# EAGLE design mysensor (EAGLE 7.5.0)
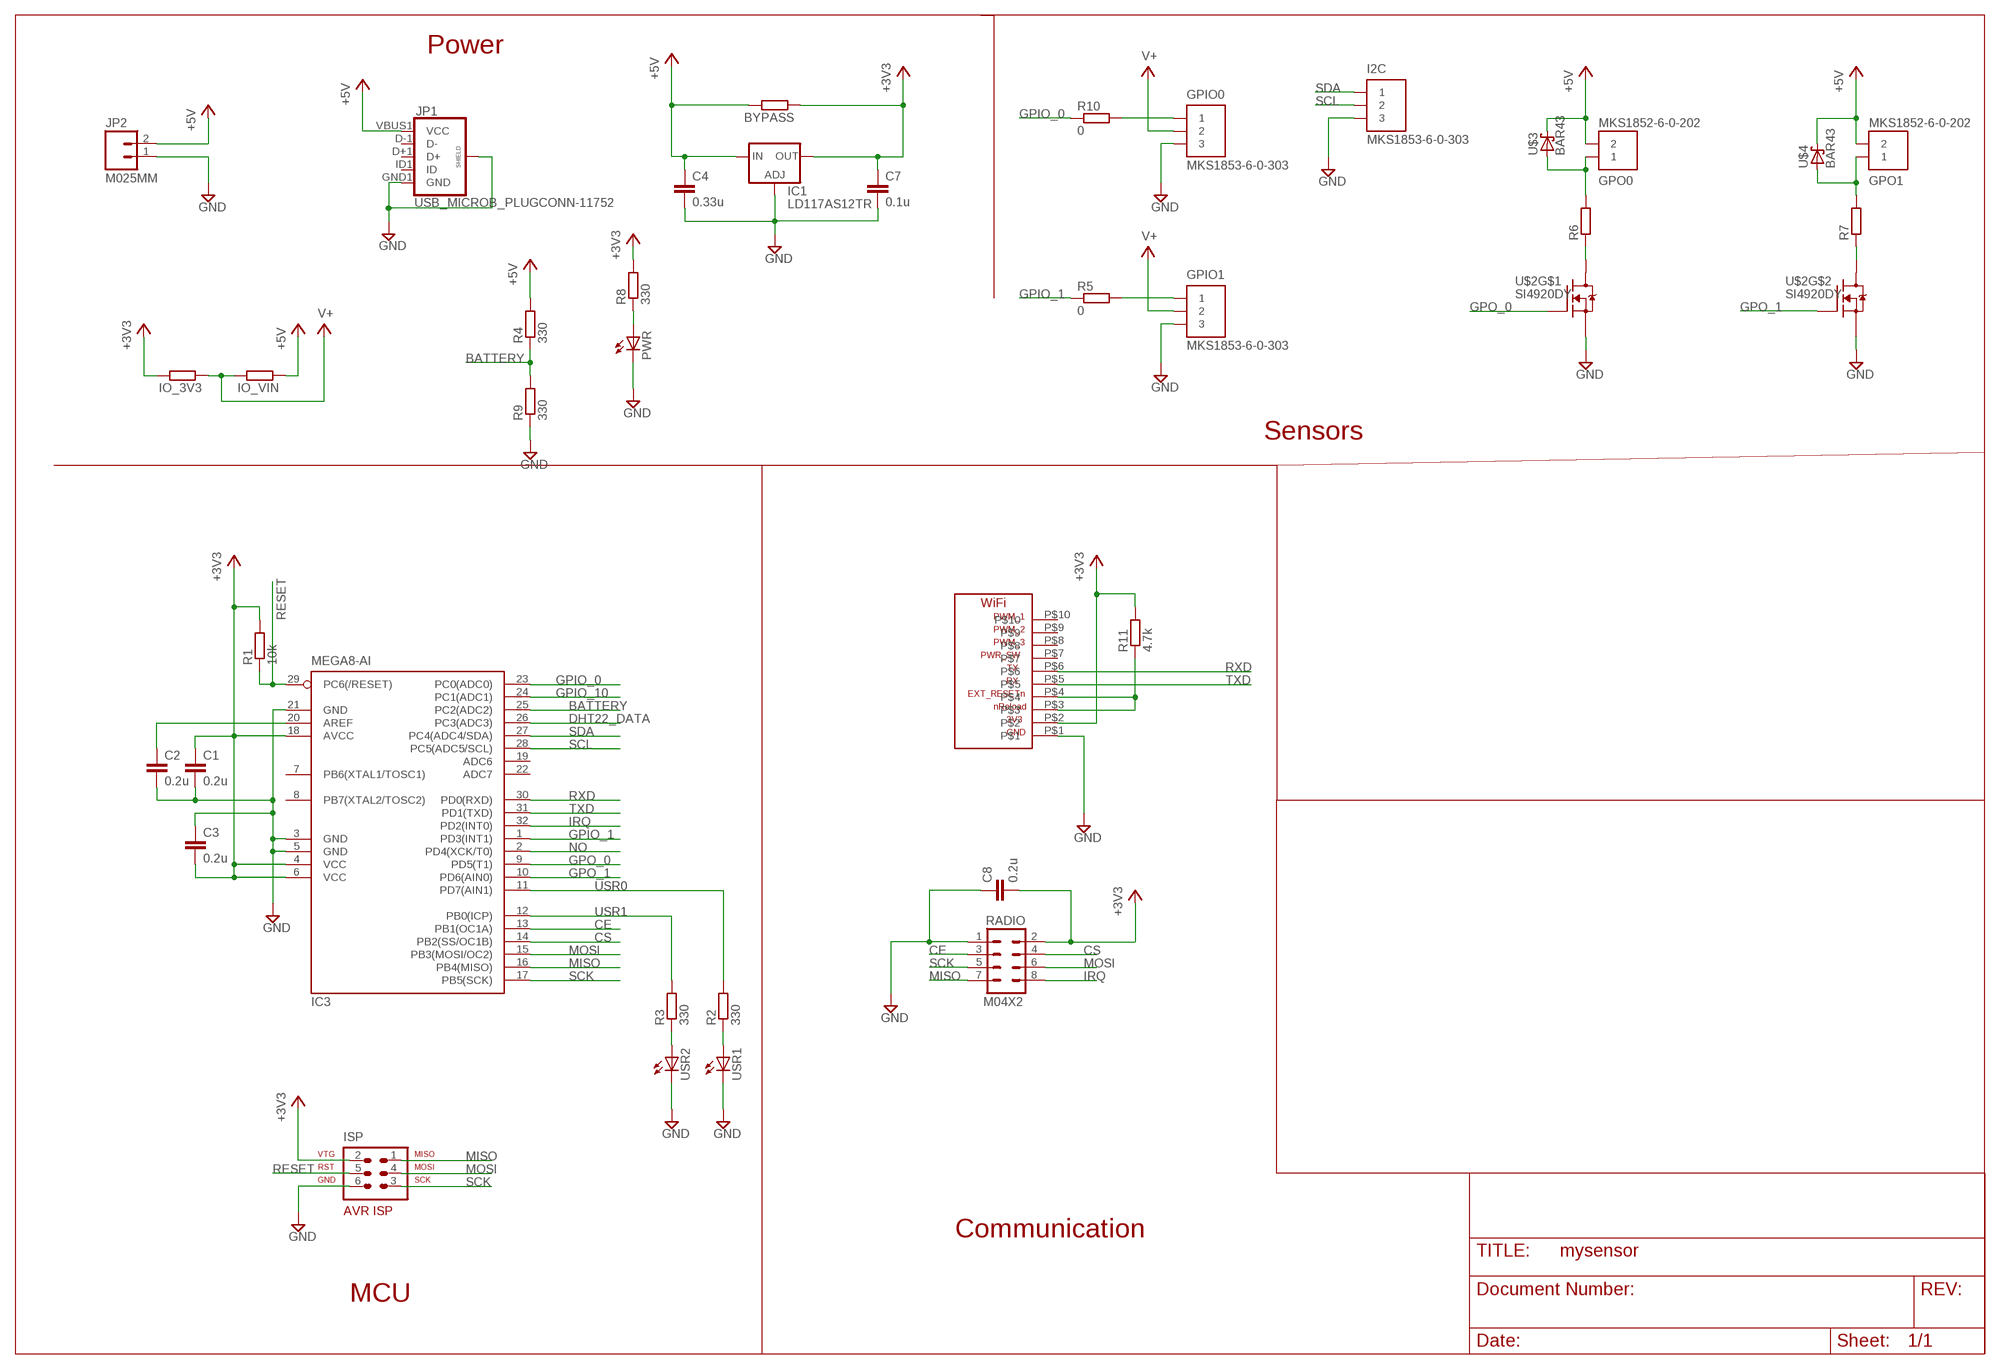
[diagram p0: schematic, sheet 1]

## Parts
BYPASS  R-EU_M0805  [M0805]
C1  0.2u  C-EUC0805  [C0805]
C2  0.2u  C-EUC0805  [C0805]
C3  0.2u  C-EUC0805  [C0805]
C4  0.33u  C-EUC0805  [C0805]
C7  0.1u  C-EUC0805  [C0805]
C8  0.2u  C-EUC0805  [C0805]
GPIO0  MKS1853-6-0-303  [MKS1853-6-0-303]
GPIO1  MKS1853-6-0-303  [MKS1853-6-0-303]
GPO0  MKS1852-6-0-202  [MKS1852-6-0-202]
GPO1  MKS1852-6-0-202  [MKS1852-6-0-202]
I2C  MKS1853-6-0-303  [MKS1853-6-0-303]
IC1  LD117AS12TR  [SOT223]
IC3  MEGA8-AI  [TQFP32-08]
IO_3V3  R-EU_M0805  [M0805]
IO_VIN  R-EU_M0805  [M0805]
ISP  AVR-ISP-6  [AVR-ISP-6]
JP1  USB_MICROB_PLUGCONN-11752  [USB-B-MICRO-SMD_V03]
JP2  M025MM  [SCREWTERMINAL-5MM-2]
PWR  LEDCHIP-LED0805  [CHIP-LED0805]
R1  10k  R-EU_R0805  [R0805]
R2  330  R-EU_M0805  [M0805]
R3  330  R-EU_M0805  [M0805]
R4  330  R-EU_M0805  [M0805]
R5  0  R-EU_R0805  [R0805]
R6  R-EU_M0805  [M0805]
R7  R-EU_M0805  [M0805]
R8  330  R-EU_M0805  [M0805]
R9  330  R-EU_M0805  [M0805]
R10  0  R-EU_R0805  [R0805]
R11  4.7k  R-EU_M0805  [M0805]
RADIO  M04X2  [2X4]
U$1  WIFI232  [WLAN]
U$2  SI4920DY  [SO-8]
U$3  BAR43  [SOT23]
U$4  BAR43  [SOT23]
USR1  LEDCHIP-LED0805  [CHIP-LED0805]
USR2  LEDCHIP-LED0805  [CHIP-LED0805]

## Nets
+3V3: BYPASS.1 C1.1 C3.2 C7.1 C8.2 IC1.4(OUT) IC3.4(VCC) IC3.6(VCC) IC3.18(AVCC) IO_3V3.2 ISP.2 R1.2 R8.2 R11.2 RADIO.2 U$1.P$2
+5V: BYPASS.2 C4.1 GPO0.2 GPO1.2 IC1.3(IN) IO_VIN.1 JP1.VBUS1(VCC) JP2.2 R4.2 U$3.3(C) U$4.3(C)
BATTERY: IC3.25(PC2(ADC2)) R4.1 R9.2
CE: IC3.13(PB1(OC1A)) RADIO.3
CS: IC3.14(PB2(SS/OC1B)) RADIO.4
DHT22_DATA: IC3.26(PC3(ADC3))
GND: C1.2 C2.2 C3.1 C4.2 C7.2 C8.1 GPIO0.3 GPIO1.3 I2C.3 IC1.1(ADJ) IC3.3(GND) IC3.5(GND) IC3.21(GND) ISP.6 JP1.GND1(GND) JP1.SHIELD1(SHIELD) JP1.SHIELD2(SHIELD) JP1.SHIELD3(SHIELD) JP2.1 PWR.C R9.1 RADIO.1 U$1.P$1 U$2.1(S) U$2.3(S) USR1.C USR2.C
GPIO_0: IC3.23(PC0(ADC0)) R10.1
GPIO_1: IC3.1(PD3(INT1)) R5.1
GPIO_10: IC3.24(PC1(ADC1))
GPO_0: IC3.9(PD5(T1)) U$2.2(G)
GPO_1: IC3.10(PD6(AIN0)) U$2.4(G)
IRQ: IC3.32(PD2(INT0)) RADIO.8
MISO: IC3.16(PB4(MISO)) ISP.1 RADIO.7
MOSI: IC3.15(PB3(MOSI/OC2)) ISP.4 RADIO.6
N$1: R6.1 U$2.7(D1)
N$2: PWR.A R8.1
N$3: R2.1 USR1.A
N$4: R3.1 USR2.A
N$5: GPO0.1 R6.2 U$3.1(A)
N$6: GPIO1.1 R5.2
N$7: R11.1 U$1.P$3 U$1.P$4
N$8: GPIO0.1 R10.2
N$9: R7.1 U$2.5(D1)
N$10: GPO1.1 R7.2 U$4.1(A)
N$11: C2.1 IC3.20(AREF)
NO: IC3.2(PD4(XCK/T0))
RESET: IC3.29(PC6(/RESET)) ISP.5 R1.1
RXD: IC3.30(PD0(RXD)) U$1.P$6
SCK: IC3.17(PB5(SCK)) ISP.3 RADIO.5
SCL: I2C.2 IC3.28(PC5(ADC5/SCL))
SDA: I2C.1 IC3.27(PC4(ADC4/SDA))
TXD: IC3.31(PD1(TXD)) U$1.P$5
USR0: IC3.11(PD7(AIN1)) R2.2
USR1: IC3.12(PB0(ICP)) R3.2
V+: GPIO0.2 GPIO1.2 IO_3V3.1 IO_VIN.2
Unconnected: IC3.7(PB6(XTAL1/TOSC1)) IC3.8(PB7(XTAL2/TOSC2)) IC3.19(ADC6) IC3.22(ADC7) JP1.D+1(D+) JP1.D-1(D-) JP1.ID1(ID) U$1.P$7 U$1.P$8 U$1.P$9 U$1.P$10 U$2.6(D) U$2.8(D)

## Notes on the sheet
- Power
- Sensors
- Communication
- MCU

## Library data of the parts
BYPASS IO_3V3 IO_VIN R1-R11 = rcl:R-EU_: RESISTOR, European symbol
C1-C4 C7 C8 = rcl:C-EU: CAPACITOR, European symbol
GPIO0 GPIO1 I2C = multilib:MKS1853-6-0-303: Serie MKS 1850 Lötstifte In-line, Raster 2.5 mm, Stiftwannen, stehend, mit Rastlasche Source: http://www.stocko.de/de/index.php?seite=ka_rfk2_mks1850.html&rubrik=Katalog+-+RFK+2 rfk_1850.pdf; OC_FARNELL: 1141861; OC_NEWARK: unknown
GPO0 GPO1 = multilib:MKS1852-6-0-202: Serie MKS 1850 Lötstifte In-line, Raster 2.5 mm, Stiftwannen, stehend, mit Rastlasche Source: http://www.stocko.de/de/index.php?seite=ka_rfk2_mks1850.html&rubrik=Katalog+-+RFK+2 rfk_1850.pdf; OC_FARNELL: unknown; OC_NEWARK: unknown
IC1 = v-reg:LD117A?*: Low drop fixed and adjustable positive voltage regulators 1 A Source: http://www.st.com/stonline/products/literature/ds/7194/ld1117axx.pdf
IC3 = atmel:MEGA8: MICROCONTROLLER 8 Kbytes FLASH, 1 kbytes SRAM, 512 bytes EEPROM, USART, 6-channel 10 bit ADC, 2-channel 8 bit ADC Pin compatible with Atmega48, ATMega88, ATMega168 Source: avr.lbr; MPN: ATMEGA8-16AU; OC_FARNELL: 9171371; OC_NEWARK: 73M8863
ISP = avr-4:AVR-ISP-6: AVR ISP-6 Serial Programming Header
JP1 = SparkFun-Connectors:USB_MICROB_PLUG: USB Micro-B connectors Some male, some female. Watch your step!; PROD_ID: CONN-11752
JP2 = SparkFun-Connectors:M02: Standard 2-pin 0.1" header. Use with - straight break away headers ( PRT-00116) - right angle break away headers (PRT-00553) - swiss pins (PRT-00743) - machine pins (PRT-00117) - female headers (PRT-00115) Molex polarized connector foot print use with: PRT-08233 with associated crimp pins and housings. 2.54_SCREWTERM for use with PRT-10571. 3.5mm Screw Terminal footprints for PRT-08084 5mm Screw Terminal footprints for use with PRT-08432; STOREFRONT_ID: PRT-08432
PWR USR1 USR2 = led:LED: LED OSRAM: - CHIPLED LG R971, LG N971, LY N971, LG Q971, LY Q971, LO R971, LY R971 LH N974, LH R974 LS Q976, LO Q976, LY Q976 LO Q996 - Hyper CHIPLED LW Q18S LB Q993, LB Q99A, LB R99A - SideLED LS A670, LO A670, LY A670, LG A670, LP A670 LB A673, LV A673, LT A673, LW A673 LH A674 LY A675 LS A676, LA A676, LO A676, LY A676, LW A676 LS A679, LY A679, LG A679 - Hyper Micro SIDELED® LS Y876, LA Y876, LO Y876, LY Y876 LT Y87S - SmartLED LW L88C, LW L88S LB L89C, LB L89S, LG L890 LS L89K, LO L89K, LY L89K LS L896, LA L896, LO L896, LY L896 - TOPLED LS T670, LO T670, LY T670, LG T670, LP T670 LSG T670, LSP T670, LSY T670, LOP T670, LYG T670 LG T671, LOG T671, LSG T671 LB T673, LV T673, LT T673, LW T673 LH T674 LS T676, LA T676, LO T676, LY T676, LB T676, LH T676, LSB T676, LW T676 LB T67C, LV T67C, LT T67C, LS T67K, LO T67K, LY T67K, LW E67C LS E67B, LA E67B, LO E67B, LY E67B, LB E67C, LV E67C, LT E67C LW T67C LS T679, LY T679, LG T679 LS T770, LO T770, LY T770, LG T770, LP T770 LB T773, LV T773, LT T773, LW T773 LH T774 LS E675, LA E675, LY E675, LS T675 LS T776, LA T776, LO T776, LY T776, LB T776 LHGB T686 LT T68C, LB T68C - Hyper Mini TOPLED® LB M676 - Mini TOPLED Santana® LG M470 LS M47K, LO M47K, LY M47K Source: http://www.osram.convergy.de LUXEON: - LUMILED® LXK2-PW12-R00, LXK2-PW12-S00, LXK2-PW14-U00, LXK2-PW14-V00 LXK2-PM12-R00, LXK2-PM12-S00, LXK2-PM14-U00 LXK2-PE12-Q00, LXK2-PE12-R00, LXK2-PE12-S00, LXK2-PE14-T00, LXK2-PE14-U00 LXK2-PB12-K00, LXK2-PB12-L00, LXK2-PB12-M00, LXK2-PB14-N00, LXK2-PB14-P00, LXK2-PB14-Q00 LXK2-PR12-L00, LXK2-PR12-M00, LXK2-PR14-Q00, LXK2-PR14-R00 LXK2-PD12-Q00, LXK2-PD12-R00, LXK2-PD12-S00 LXK2-PH12-R00, LXK2-PH12-S00 LXK2-PL12-P00, LXK2-PL12-Q00, LXK2-PL12-R00 Source: www.luxeon.com KINGBRIGHT: KA-3528ASYC Source: www.kingbright.com
RADIO = SparkFun-Connectors:M04X2: .1" header, two rows of four.
U$1 = multilib:WIFI232
U$2 = multilib:SI4920DY
U$3 U$4 = multilib:BAR43

## Board
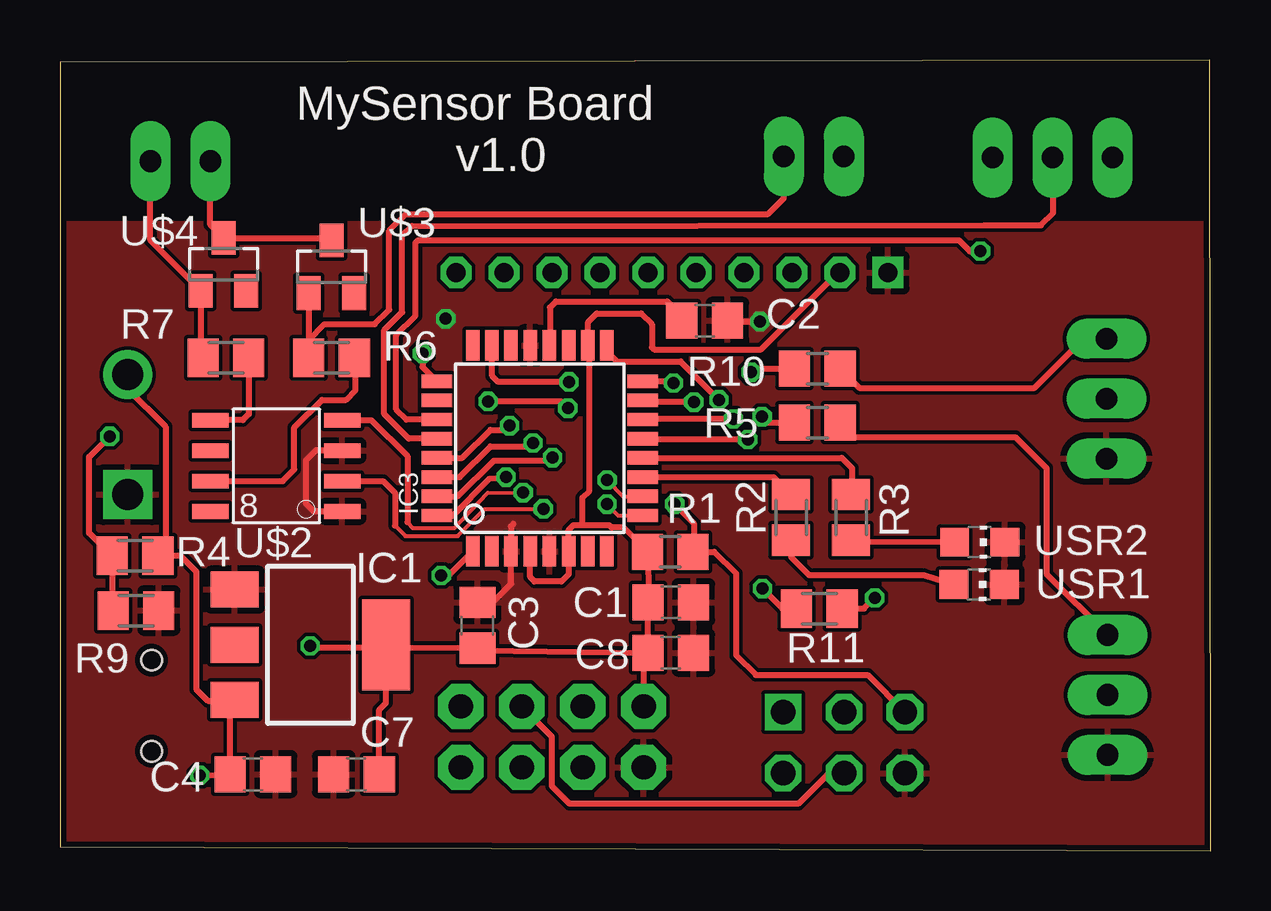
[diagram p1: board, top side]
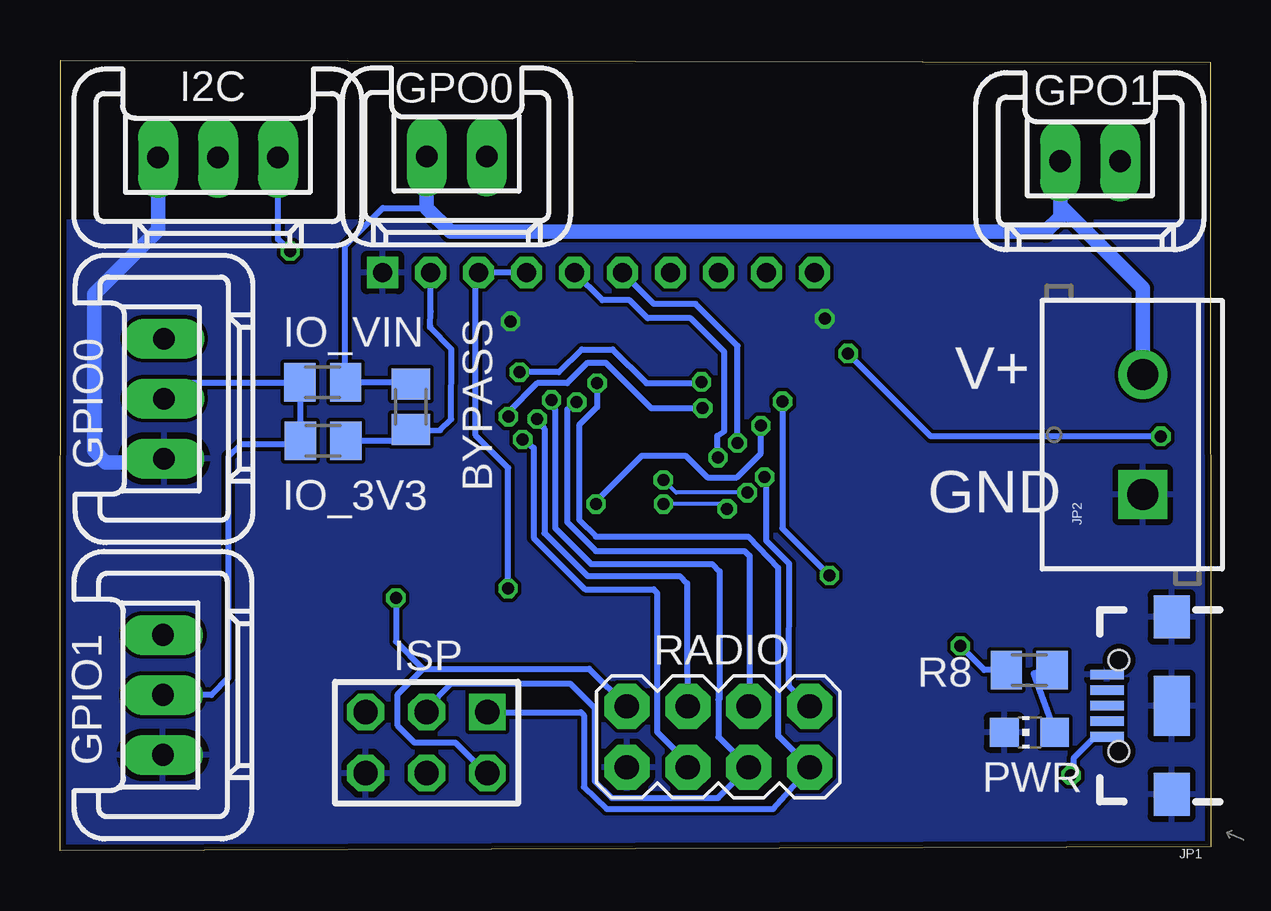
[diagram p2: board, bottom side, seen from below]

Size 47.96 x 32.96 mm. Coordinates in mm from the lower left corner, seen from the top.
Outline: 0,0.16 47.96,0 47.93,32.96 0.02,32.87 0,0.16
Copper layers (1*16): Top 0.035mm / dielectric 1.5mm / Bottom 0.035mm
Design rules "ITead_rule": minimum track width 6mil, minimum drill 12mil, track to track 6mil, track to pad 6mil, pad to pad 6mil, via to via 6mil, smd to smd 0mil, copper to edge 10mil, drill to drill 10mil, minimum pad ring 10mil, minimum via ring 6mil, stop-mask expansion 2mil, vias tented up to drill 100mil, thermal gap 10mil

### Footprints (pad centres in the part's own frame; a part is rotated, then mirrored left to right if it is on the bottom)
M0805 = smd 1.3 x 1.6: 1 -0.95,0; 2 0.95,0
C0805 = smd 1.3 x 1.5: 1 -0.95,0; 2 0.95,0
MKS1853-6-0-303 = drill 0.9 pad 1.676 long: 1 -2.5,0; 2 0,0; 3 2.5,0
MKS1852-6-0-202 = drill 0.9 pad 1.676 long: 1 -1.25,0; 2 1.25,0
SOT223 = smd 1.5 x 2: 1 -2.3,-3.15; 2 0,-3.15; 3 2.3,-3.15 | smd 3.8 x 2: 4 0,3.15
TQFP32-08 = smd 1.27 x 0.559: 1 -4.293,2.8; 2 -4.293,2; 3 -4.293,1.2; 4 -4.293,0.4; 5 -4.293,-0.4; 6 -4.293,-1.2; 7 -4.293,-2; 8 -4.293,-2.8; 17 4.293,-2.8; 18 4.293,-2; 19 4.293,-1.2; 20 4.293,-0.4; 21 4.293,0.4; 22 4.293,1.2; 23 4.293,2; 24 4.293,2.8 | smd 0.559 x 1.27: 9 -2.8,-4.293; 10 -2,-4.293; 11 -1.2,-4.293; 12 -0.4,-4.293; 13 0.4,-4.293; 14 1.2,-4.293; 15 2,-4.293; 16 2.8,-4.293; 25 2.8,4.293; 26 2,4.293; 27 1.2,4.293; 28 0.4,4.293; 29 -0.4,4.293; 30 -1.2,4.293; 31 -2,4.293; 32 -2.8,4.293
AVR-ISP-6 = drill 1.016 square: 1 -2.54,-1.27 | drill 1.016 octagon: 2 -2.54,1.27; 3 0,-1.27; 4 0,1.27; 5 2.54,-1.27; 6 2.54,1.27
USB-B-MICRO-SMD_V03 = smd 1.4 x 0.4: D+1 2.7,0; D-1 2.7,0.65; GND1 2.7,-1.3; ID1 2.7,-0.65; VBUS1 2.7,1.3 | smd 1.5 x 1.8: SHIELD1 0,3.7; SHIELD2 0,-3.7 | smd 1.5 x 2.5: SHIELD3 0,0 | hole 0.85: 2.2,1.9; 2.2,-1.9
SCREWTERMINAL-5MM-2 = drill 1.3 pad 2.032 square: 1 0,0 | drill 1.3 pad 2.032: 2 5,0
CHIP-LED0805 = smd 1.2 x 1.2: A 0,-1.05; C 0,1.05
R0805 = smd 1.3 x 1.5: 1 -0.95,0; 2 0.95,0
2X4 = drill 1.016 pad 1.88 octagon: 1 -3.81,-1.27; 2 -3.81,1.27; 3 -1.27,-1.27; 4 -1.27,1.27; 5 1.27,-1.27; 6 1.27,1.27; 7 3.81,-1.27; 8 3.81,1.27
WLAN = drill 0.8 square: P$1 19.99,11.81 | drill 0.8 octagon: P$2 17.99,11.81; P$3 15.99,11.81; P$4 13.99,11.81; P$5 11.99,11.81; P$6 9.99,11.81; P$7 7.99,11.81; P$8 5.99,11.81; P$9 3.99,11.81; P$10 1.99,11.81
SO-8 = smd 1.524 x 0.61: 1 -2.743,1.905; 2 -2.743,0.635; 3 -2.743,-0.635; 4 -2.743,-1.905; 5 2.743,-1.905; 6 2.743,-0.635; 7 2.743,0.635; 8 2.743,1.905
SOT23 = smd 1 x 1.4: 1 -0.95,-1.1; 2 0.95,-1.1; 3 0,1.1

### Placement (x,y rotation side)
BYPASS  33.33,18.5 90 bottom
C1  25.46,10.35 0 top
C2  26.87,22.09 0 top
C3  17.4,9.39 270 top
C4  8.04,3.18 0 top
C7  12.36,3.18 180 top
C8  25.46,8.25 180 top
GPIO0  43.62,18.84 270 bottom
GPIO1  43.67,6.49 270 bottom
GPO0  31.42,28.94 180 bottom
GPO1  5.02,28.74 180 bottom
I2C  41.37,28.89 180 bottom
IC1  10.44,8.58 270 top
IC3  20,16.77 90 top
IO_3V3  36.99,17.08 0 bottom
IO_VIN  37.01,19.52 180 bottom
ISP  32.68,4.5 180 bottom
JP1  1.62,6.04 180 bottom
JP2  2.82,14.84 90 bottom
PWR  7.55,4.93 90 bottom
R1  25.44,12.46 180 top
R2  30.47,13.89 90 top
R3  32.97,13.89 90 top
R4  3.13,12.3 0 top
R5  31.57,17.84 0 top
R6  11.32,20.54 180 top
R7  6.92,20.54 180 top
R8  7.56,7.53 180 bottom
R9  3.17,10.01 180 top
R10  31.57,20.09 0 top
R11  31.65,10.09 0 top
RADIO  20.52,4.74 0 bottom
U$1  14.52,12.29 0 top
U$2  9.02,16.04 180 top
U$3  11.32,24.34 0 top
U$4  6.82,24.44 0 top
USR1  38.31,11.09 270 top
USR2  38.34,12.86 270 top

### Tracks (layer width: path | path; a pad name or v marks a point on that pad's centre or on a via)
+3V3  (via drill 0.5)
  Top 0.254: C8.2 C1.1 | C1.1 24.56,10.55 R1.2 23.48,13.47 22.99,13.47 22.89,13.57 21.76,13.57 | 24.32,10.79 C1.1 | 13.69,8.48 IC1.4 13.59,6.15 13.31,5.87 C7.1 | 22.02,21.04 IC3.18 | 22.02,21.04 22.07,20.99 22.07,15 21.77,14.7 21.77,13.58 21.76,13.57 | 22.02,21.04 22.02,22.04 22.37,22.39 24.22,22.39 24.67,21.94 24.67,20.99 24.77,20.89 29.22,20.89 32.43,24.1 U$1.P$2 | 19.63,12.51 IC3.4 19.6,11.4 19.78,11.22 20.9,11.22 21.2,11.52 IC3.6 21.2,13.37 21.4,13.57 21.76,13.57 | 13.69,8.48 C3.2 17.5,8.34 C8.2 | C8.2 24.33,8.08 RADIO.2 | v10.43,8.53 10.48,8.48 13.69,8.48 | R11.2 33.52,10.09 v33.96,10.53
  Bottom 0.254: ISP.2 30.21,3.23 31.48,4.5 33.18,4.5 33.88,5.2 33.88,6.52 32.82,7.58 | 10.39,8.49 v10.43,8.53 9.43,7.53 R8.2 | IO_3V3.2 33.04,17.08 BYPASS.1 32.6,17.52 32.11,17.53 31.65,17.98 31.64,20.89 32.55,21.82 32.53,21.87 32.51,22.48 U$1.P$2 | 32.82,7.58 25.9,7.58 RADIO.2 | v33.96,10.53 33.96,8.72 32.82,7.58
+5V  (via drill 0.5)
  Top 0.254: U$3.3 11.22,25.54 U$4.3 6.27,26.09 GPO1.2 | v5.82,3.14 C4.1 7.09,6.08 IC1.3 7.26,6.25 6.16,6.25 5.68,6.73 5.68,11.63 5.01,12.3 R4.2 4.4,12.62 4.4,17.67 2.82,19.25 JP2.2
  Bottom 0.254: JP1.VBUS1 4.82,4.74 5.72,3.84 5.72,3.24 v5.82,3.14 5.92,3.24 | BYPASS.2 32.96,19.52 IO_VIN.1 36.08,19.54 36.08,25.22 34.51,26.79 32.67,26.79
  Bottom 0.61: JP2.2 2.82,23.44 6.27,26.89 | GPO0.2 32.67,26.79 31.68,25.8 6.88,25.8 6.27,26.41 6.27,26.89 | 6.27,26.89 6.27,28.07 GPO1.2 6.27,28.69
BATTERY  (via drill 0.5)
  Top 0.254: R9.2 2.18,10.05 R4.1 2.15,12.3 1.21,13.24 1.21,16.41 v2.07,17.27 | v15.11,20.73 15.11,20.17 IC3.25
  Bottom 0.254: v2.07,17.27 11.65,17.27 v15.11,20.73
CE  (via drill 0.5)
  Top 0.254: v28.67,17.14 23.99,17.13 IC3.13
  Bottom 0.254: RADIO.3 21.79,3.66 23.07,4.94 23.07,10.74 23.22,10.89 26.07,10.89 28.22,13.04 28.22,16.79 v28.67,17.14
CS  (via drill 0.5)
  Top 0.254: v28.07,17.99 24.31,17.99 IC3.14
  Bottom 0.254: RADIO.4 21.79,7.21 21.82,7.24 21.82,11.14 22.12,11.44 25.97,11.44 27.77,13.24 27.77,17.59 v28.07,17.99
GND  (via drill 0.5)
  Top 0.254: U$2.1 10.57,14.13 10.27,14.44 10.27,16.29 10.67,16.69 11.75,16.69 U$2.3 | 18.79,11.1 18.79,12.47 IC3.3 18.8,13.52 18.9,13.62 | 18.79,11.1 18.82,11.13 | C3.1 18.03,10.34 18.79,11.1 | C2.2 27.85,22.06 v29.18,22.06
  Bottom 0.254: v29.18,22.06 29.3,22.18 29.47,22.18
  Bottom 0.61: I2C.3 43.87,25.86 46.54,23.19 46.54,16.67 46.05,16.18 43.78,16.18 GPIO0.3
  other vias: 16.08,22.17
  pour Bottom: 47.98,25.92 47.9,0.2 0.01,0.2 0.01,26.17 47.97,26.17
  pour Top: 47.94,26.16 47.98,0.17 -0.03,0.17 -0.03,26.14
GPIO_0  (via drill 0.5)
  Top 0.254: v21.22,19.54 18.27,19.54 18.02,19.79 18.02,21.04 IC3.23 | v28.81,19.94 29.07,20.09 R10.1
  Bottom 0.254: v21.22,19.54 21.27,19.49 23.52,19.49 24.92,20.89 26.22,20.89 27.17,19.94 v28.81,19.94
GPIO_1  (via drill 0.5)
  Top 0.254: v29.27,18.09 29.52,17.84 R5.1 | v21.17,18.44 20.88,18.73 v17.84,18.73 | v15.89,11.47 16.19,11.47 IC3.1
  Bottom 0.254: v21.17,18.44 23.32,18.44 25.22,20.34 25.97,20.34 26.82,19.49 28.07,19.49 29.27,18.29 v29.27,18.09 | v17.84,18.73 v17.85,18.72 17.85,13.43 v15.89,11.47
GPO_0  (via drill 0.5)
  Top 0.17: 13.96,13.55 14.4,13.11 16.58,13.11 17.7,14.24 v20.15,14.25 | v22.8,14.44 23.27,13.97 IC3.9
  Top 0.254: U$2.2 13.46,15.4 13.96,14.91 13.96,13.55 | 24.19,14.07 IC3.9
  Bottom 0.17: v20.15,14.25 20.34,14.44 v22.8,14.44
GPO_1  (via drill 0.5)
  Top 0.17: 14.48,13.68 14.7,13.44 16.44,13.44 17.83,14.91 v19.31,14.92 | 24.26,14.8 IC3.10 23.46,14.77 v22.81,15.45
  Top 0.254: U$2.4 12.97,17.95 14.48,16.44 14.48,13.68 | 24.12,14.94 IC3.10
  Bottom 0.17: v19.31,14.92 22.28,14.92 v22.81,15.45
IRQ  (via drill 0.5)
  Top 0.254: IC3.32 16.37,13.95 17.91,15.51 18.43,15.53 v18.59,15.57
  Bottom 0.254: RADIO.8 17.57,6.87 17.56,11.75 17.56,11.95 18.52,12.91 18.52,15.46 v18.59,15.57 18.42,15.49
MISO  (via drill 0.5)
  Top 0.254: IC3.16 25.49,19.57 v25.57,19.49
  Bottom 0.254: v25.57,19.49 25.57,18.49 26.32,17.74 26.32,13.79 25.62,13.09 19.27,13.09 18.02,11.79 18.02,4.78 RADIO.7 18.24,1.74 25.17,1.74 26.12,2.64 26.12,5.64 26.25,5.77 ISP.1
MOSI  (via drill 0.5)
  Top 0.254: v26.42,18.69 24.37,18.69 IC3.15 | ISP.4 32.05,3.23 30.78,1.96 21.23,1.96 20.51,2.68 20.51,4.75 RADIO.6
  Bottom 0.254: 19.25,6.17 RADIO.6 19.22,6.04 19.22,12.29 19.42,12.49 25.62,12.49 26.82,13.69 26.82,18.39 v26.42,18.69
N$1
  Top 0.254: U$2.7 9.29,15.4 9.77,15.89 9.77,17.64 10.92,18.79 11.92,18.79 12.32,19.19 12.32,20.49 R6.1
N$2
  Bottom 0.254: R8.1 7.38,7.38 PWR.A
N$3
  Top 0.254: R2.1 30.47,12.24 31.22,11.49 36.02,11.49 USR1.A
N$4
  Top 0.254: USR2.A 33.06,12.85 R3.1
N$5
  Top 0.254: U$3.1 R6.2 10.37,21.29 11.02,21.94 13.12,21.94 13.72,22.54 13.72,25.84 14.42,26.54 29.52,26.54 30.17,27.19 GPO0.1
N$6
  Top 0.254: GPIO1.1 41.12,11.54 41.12,15.94 39.82,17.24 33.12,17.24 R5.2
N$7  (via drill 0.5)
  Top 0.254: R11.1 30.11,10.09 v29.28,10.92
  Bottom 0.254: v29.28,10.92 29.28,15.96 30.63,17.31 30.63,23.98 U$1.P$3 U$1.P$4
N$8
  Top 0.254: R10.2 33.32,19.29 40.62,19.29 42.67,21.34 GPIO0.1
N$9
  Top 0.254: R7.1 7.87,18.19 7.62,17.94 U$2.5
N$10
  Top 0.254: R7.2 5.87,20.64 U$4.1 3.77,25.44 GPO1.1
N$11
  Top 0.254: IC3.20 20.42,21.08 20.42,22.64 20.67,22.89 25.32,22.89 25.92,22.29 C2.1
RESET  (via drill 0.5)
  Top 0.254: v25.62,14.44 26.42,13.64 26.42,12.68 R1.1 27.27,12.46 28.18,11.55 28.18,8.14 29,7.32 33.67,7.32 ISP.5 | IC3.29 16.77,16.37 17.94,17.54 18.73,17.54 v18.74,17.71
  Bottom 0.254: v18.74,17.71 18.75,16.56 19.75,15.56 20.98,15.56 21.89,16.47 23.7,16.47 25.62,14.55 v25.62,14.44
RXD  (via drill 0.5)
  Top 0.254: IC3.30 16.66,15.57 17.94,16.85 19.58,16.85 v19.72,16.99
  Bottom 0.254: v19.72,16.99 19.72,21.04 21.47,22.79 23.2,22.79 U$1.P$6
SCK  (via drill 0.5)
  Top 0.254: IC3.17 22.8,20.81 23.22,20.39 25.87,20.39 v27.47,18.79
  Bottom 0.254: v27.47,18.79 27.47,18.69 27.32,18.34 27.32,13.44 25.82,11.94 20.77,11.94 20.47,11.64 20.47,6.34 20.52,6.29 | 20.52,6.69 20.52,6.29 | 20.52,6.29 20.52,4.74 RADIO.5 20.53,2.19 24.97,2.19 25.67,2.89 25.67,5.94 26.69,6.96 31.65,6.96 32.68,5.93 ISP.3
SCL
  Top 0.254: IC3.28 14.54,17.17 13.52,18.19 13.52,21.69 14.27,22.44 14.27,25.64 14.67,26.04 38.52,26.07 40.89,26.07 41.4,26.58 41.4,28.86 I2C.2
SDA  (via drill 0.5)
  Top 0.254: IC3.27 14.44,17.97 14.02,18.39 14.02,21.49 14.82,22.29 14.82,25.34 14.92,25.44 37.47,25.44 37.92,24.99 v38.37,24.99
  Bottom 0.254: v38.37,24.99 38.87,25.49 I2C.1
TXD  (via drill 0.5)
  Top 0.254: IC3.31 16.57,14.77 18.09,16.26 20.36,16.26 v20.53,16.38
  Bottom 0.254: U$1.P$5 25.35,22.94 24.22,22.94 23.47,22.19 21.67,22.19 20.27,20.79 20.27,17.49 20.57,17.29 20.57,16.42 v20.53,16.38
USR0
  Top 0.254: IC3.11 29.74,15.57 R2.2
USR1
  Top 0.254: IC3.12 32.59,16.37 33.02,15.94 33.02,14.89 R3.2
V+
  Bottom 0.254: GPIO0.2 42.94,19.52 IO_VIN.2 37.94,19.5 IO_3V3.1 38.09,16.93 40.43,16.93 40.94,16.42 40.94,7.19 41.64,6.49 GPIO1.2

### Text on the board
tNames: MySensor Board | v1.0
bNames: V+ | GND